# Altium project SiemensKarre.PrjPcb
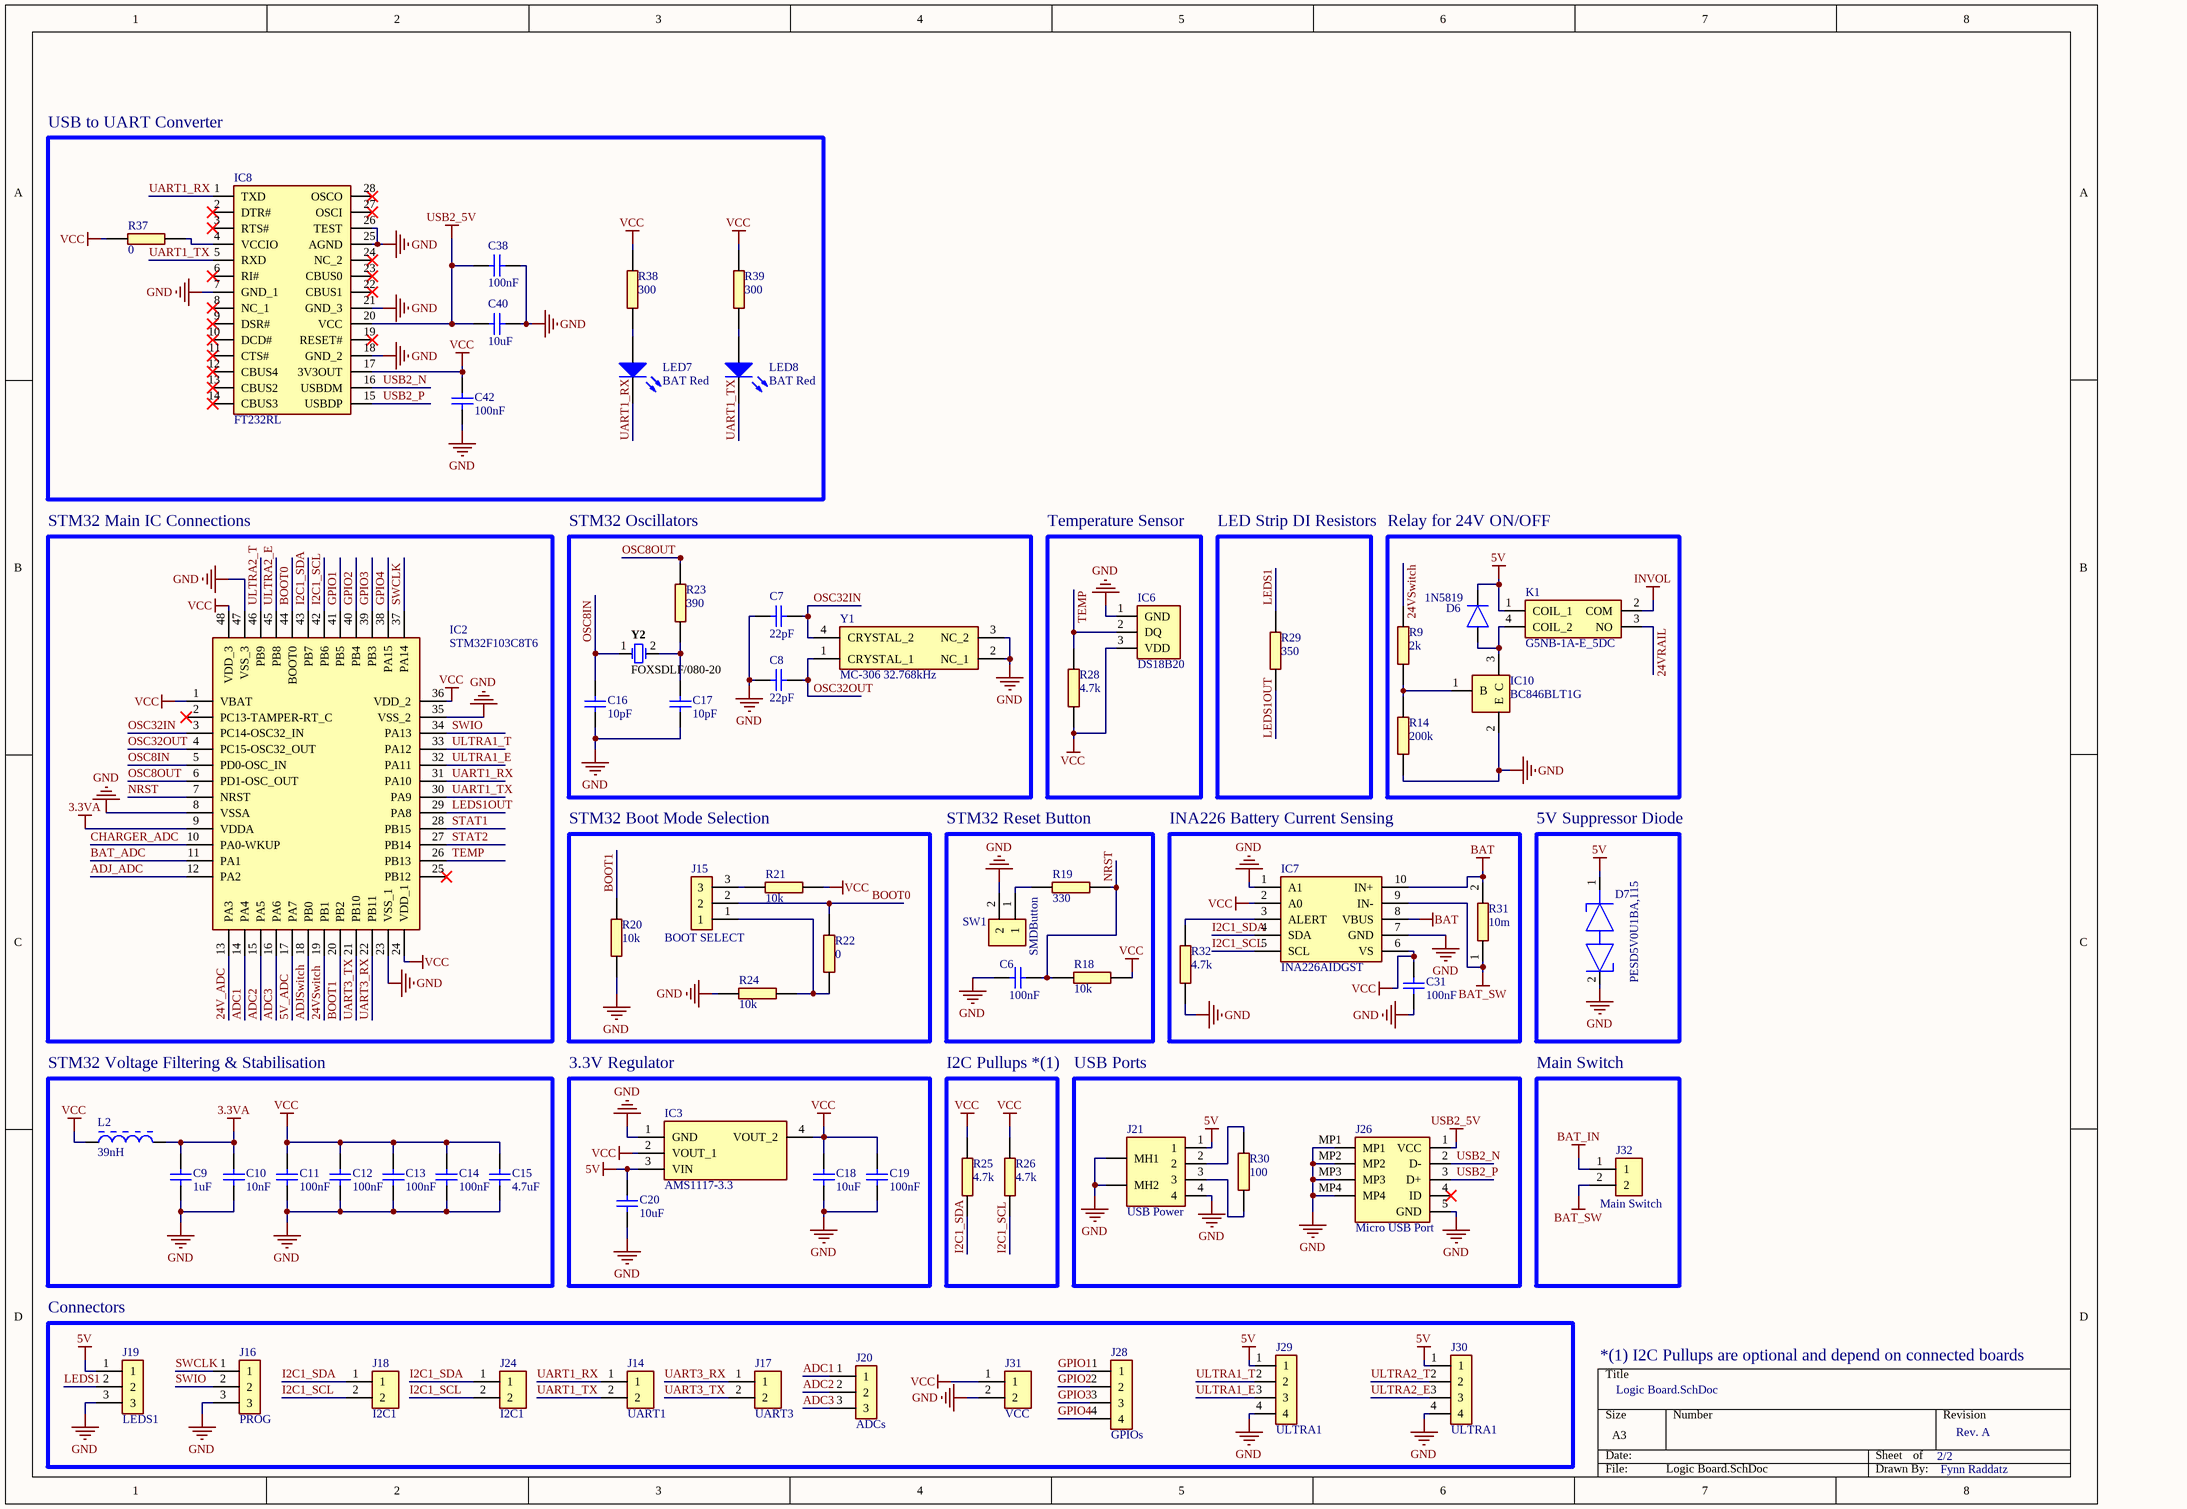
[diagram p0: Logic Board.SchDoc]
2 sheets, 145 parts. Net scope: global (net labels, ports and power ports of the same name join across sheets).
Board file: PSU PCB.PcbDoc
Sheets:
  Logic Board.SchDoc
  PSU Board.SchDoc

## Sheet Logic Board.SchDoc
size A3; SheetNumber: 1; SheetTotal: 2

### Parts
C6  100nF  [CAPC2012 METRIC]
C7  22pF  [CAPC2012 METRIC]
C8  22pF  [CAPC2012 METRIC]
C9  1uF  [CAPC2012 METRIC]
C10  10nF  [CAPC2012 METRIC]
C11  100nF  [CAPC2012 METRIC]
C12  100nF  [CAPC2012 METRIC]
C13  100nF  [CAPC2012 METRIC]
C14  100nF  [CAPC2012 METRIC]
C15  4.7uF  [CAPC2012 METRIC]
C16  10pF  [CAPC2012 METRIC]
C17  10pF  [CAPC2012 METRIC]
C18  10uF  [CAPC2012 METRIC]
C19  100nF  [CAPC2012 METRIC]
C20  10uF  [CAPC2012 METRIC]
C31  100nF  [CAPC2012 METRIC]
C38  100nF  [CAPC2012 METRIC]
C40  10uF  [CAPC2012 METRIC]
C42  100nF  [CAPC2012 METRIC]
D6  1N5819  [SOD3716X145N]
D7  PESD5V0U1BA,115  [PESD1IVN27AX]
IC2  STM32F103C8T6  [QFP50P900X900X160-48N]
IC3  AMS1117-3.3  [SOT229P700X180-4N]
IC6  DS18B20  [DS18B20TR]
IC7  INA226AIDGST  [SOP50P490X110-10N]
IC8  FT232RL  [SOP65P778X200-28N]
IC10  BC846BLT1G  [SOT96P237X111-3N]
J14  UART1  [2 Pin Header BIG PADS]
J15  BOOT SELECT  [HDRV3W64P0X254_1X3_762X254X869P]
J16  PROG  [HDRV3W64P0X254_1X3_762X254X869P]
J17  UART3  [2 Pin Header BIG PADS]
J18  I2C1  [2 Pin Header BIG PADS]
J19  LEDS1  [HDRV3W64P0X254_1X3_762X254X869P]
J20  ADCs  [HDRV3W64P0X254_1X3_762X254X869P]
J21  USB Power  [875200010BLF]
J24  I2C1  [2 Pin Header BIG PADS]
J26  Micro USB Port  [101041100001LF]
J28  GPIOs  [HDRV4W95P0X254_1X4_1016X254X854P]
J29  ULTRA1  [HDRV4W95P0X254_1X4_1016X254X854P]
J30  ULTRA1  [HDRV4W95P0X254_1X4_1016X254X854P]
J31  VCC  [2 Pin Header BIG PADS]
J32  Main Switch  [2 Pin Header BIG PADS]
K1  G5NB-1A-E_5DC  [G5NB1A4DC5]
L2  39nH  [LIRD-LI0805H151R-10-2_V]
LED7  BAT Red  [1206_A]
LED8  BAT Red  [1206_A]
R9  2k  [RESC2012X65N]
R14  200k  [RESC2012X65N]
R18  10k  [RESC2012X65N]
R19  330  [RESC2012X65N]
R20  10k  [RESC2012X65N]
R21  10k  [RESC2012X65N]
R22  0  [RESC2012X65N]
R23  390  [RESC2012X65N]
R24  10k  [RESC2012X65N]
R25  4.7k  [RESC2012X65N]
R26  4.7k  [RESC2012X65N]
R28  4.7k  [RESC2012X65N]
R29  350  [RESC2012X65N]
R30  100  [RESC2012X65N]
R31  10m  [RESC5025X88N]
R32  4.7k  [RESC2012X65N]
R37  0  [RESC2012X65N]
R38  300  [RESC2012X65N]
R39  300  [RESC2012X65N]
SW1  SMDButton  [SMD-Button-3*6mm]
Y1  MC-306 32.768kHz  [MC306327680KA3ROHS]
Y2  FOXSDLF/080-20  [FOX-HC49SDLF_V]

### Blocks framed on the sheet
USB to UART Converter: C38 C40 C42 IC8 LED7 LED8 R37-R39
STM32 Main IC Connections: IC2
STM32 Oscillators: C7 C8 C16 C17 R23 Y1 Y2
Temperature Sensor: IC6 R28
LED Strip DI Resistors: R29
Relay for 24V ON/OFF: D6 IC10 K1 R9 R14
STM32 Boot Mode Selection: J15 R20-R22 R24
STM32 Reset Button: C6 R18 R19 SW1
INA226 Battery Current Sensing: C31 IC7 R31 R32
5V Suppressor Diode: D7
STM32 Voltage Filtering & Stabilisation: C9-C15 L2
3.3V Regulator: C18-C20 IC3
I2C Pullups *(1): R25 R26
USB Ports: J21 J26 R30
Main Switch: J32
Connectors: J14 J16-J20 J24 J28-J31

### Nets
3.3VA: C9.2 C10.2 IC2.9(VDDA) L2.2
5V: C20.2 D6.1(K) D7.1(K1) IC3.3(VIN) J19.1 J21.1 J29.1 J30.1 K1.1(COIL_1)
BAT: IC7.8(VBUS) IC7.10(IN+) R31.2
BAT_IN: J32.1
BAT_SW: IC7.9(IN-) J32.2 R31.1
GND: C6.2 C7.2 C8.2 C9.1 C10.1 C11.1 C12.1 C13.1 C14.1 C15.1 C16.1 C17.1 C18.1 C19.1 C20.1 C31.1 C38.2 C40.2 C42.2 D7.2(K2) IC2.8(VSSA) IC2.23(VSS_1) IC2.35(VSS_2) IC2.47(VSS_3) IC3.1(GND) IC6.1(GND) IC7.1(A1) IC7.7(GND) IC8.7(GND_1) IC8.18(GND_2) IC8.21(GND_3) IC8.25(AGND) IC8.26(TEST) IC10.2(E) J16.3 J19.3 J21.4 J21.MH1 J21.MH2 J26.5(GND) J26.MP1 J26.MP2 J26.MP3 J26.MP4 J29.4 J30.4 J31.2 R14.1 R20.1 R24.1 R32.2 SW1.2 Y1.2(NC_1) Y1.3(NC_2)
INVOL: K1.2(COM)
USB2_5V: C38.1 C40.1 IC8.20(VCC) J26.1(VCC)
VCC: C11.2 C12.2 C13.2 C14.2 C15.2 C18.2 C19.2 C31.2 C42.1 IC2.1(VBAT) IC2.24(VDD_1) IC2.36(VDD_2) IC2.48(VDD_3) IC3.2(VOUT_1) IC3.4(VOUT_2) IC6.3(VDD) IC7.2(A0) IC7.6(VS) IC8.17(3V3OUT) J31.1 L2.1 R18.2 R21.1 R25.1 R26.1 R28.1 R37.2 R38.2 R39.2
5V_ADC: IC2.17(PA7)
24V_ADC: IC2.13(PA3)
24VRAIL: K1.3(NO)
24VSwitch: IC2.19(PB1) R9.2
ADC1: IC2.14(PA4) J20.1
ADC2: IC2.15(PA5) J20.2
ADC3: IC2.16(PA6) J20.3
ADJ_ADC: IC2.12(PA2)
ADJSwitch: IC2.18(PB0)
BAT_ADC: IC2.11(PA1)
BOOT0: IC2.44(BOOT0) J15.2 R22.1
BOOT1: IC2.20(PB2) R20.2
CHARGER_ADC: IC2.10(PA0-WKUP)
GPIO1: IC2.41(PB5) J28.1
GPIO2: IC2.40(PB4) J28.2
GPIO3: IC2.39(PB3) J28.3
GPIO4: IC2.38(PA15) J28.4
I2C1_SCL: IC2.42(PB6) IC7.5(SCL) J18.2 J24.2 R26.2
I2C1_SDA: IC2.43(PB7) IC7.4(SDA) J18.1 J24.1 R25.2
LEDS1: J19.2 R29.2
LEDS1OUT: IC2.29(PA8) R29.1
NRST: C6.1 IC2.7(NRST) R18.1 R19.1
OSC8IN: C16.2 IC2.5(PD0-OSC_IN) Y2.1
OSC8OUT: IC2.6(PD1-OSC_OUT) R23.2
OSC32IN: C7.1 IC2.3(PC14-OSC32_IN) Y1.4(CRYSTAL_2)
OSC32OUT: C8.1 IC2.4(PC15-OSC32_OUT) Y1.1(CRYSTAL_1)
STAT1: IC2.28(PB15)
STAT2: IC2.27(PB14)
SWCLK: IC2.37(PA14) J16.1
SWIO: IC2.34(PA13) J16.2
TEMP: IC2.26(PB13) IC6.2(DQ) R28.2
UART1_RX: IC2.31(PA10) IC8.1(TXD) J14.1 LED7.1(K)
UART1_TX: IC2.30(PA9) IC8.5(RXD) J14.2 LED8.1(K)
UART3_RX: IC2.22(PB11) J17.1
UART3_TX: IC2.21(PB10) J17.2
ULTRA1_E: IC2.32(PA11) J29.3
ULTRA1_T: IC2.33(PA12) J29.2
ULTRA2_E: IC2.45(PB8) J30.3
ULTRA2_T: IC2.46(PB9) J30.2
USB2_N: IC8.16(USBDM) J26.2(D-)
USB2_P: IC8.15(USBDP) J26.3(D+)
NetC17_2: C17.2 R23.1 Y2.2
NetD6_2: D6.2(A) IC10.3(C) K1.4(COIL_2)
NetIC7_3: IC7.3(ALERT) R32.1
NetIC8_4: IC8.4(VCCIO) R37.1
NetIC10_1: IC10.1(B) R9.1 R14.2
NetJ15_1: J15.1 R22.2 R24.2
NetJ15_3: J15.3 R21.2
NetJ21_2: J21.2 R30.1
NetJ21_3: J21.3 R30.2
NetLED7_2: LED7.2(A) R38.1
NetLED8_2: LED8.2(A) R39.1
NetR19_2: R19.2 SW1.1

Not connected (* = marked no-connect by the designer): IC2 2(PC13-TAMPER-RT_C)* 25(PB12)*; IC8 2(DTR#)* 3(RTS#)* 6(RI#)* 8(NC_1)* 9(DSR#)* 10(DCD#)* 11(CTS#)* 12(CBUS4)* 13(CBUS2)* 14(CBUS3)* 19(RESET#)* 22(CBUS1)* 23(CBUS0)* 24(NC_2)* 27(OSCI)* 28(OSCO)*; J26 4(ID)*

### Notes on the sheet
- *(1) I2C Pullups are optional and depend on connected boards
- 2/2
- Rev. A
- Fynn Raddatz

### Library data of the parts
C6-C20 C31 C38 C40 C42 = CL21B104KACNNNC: Capacitor; Manufacturer_Name: Samsung Electro-Mechanics; Datasheet Link: http://www.samsungsem.com/kr/support/product-search/mlcc/__icsFiles/afieldfile/2016/08/18/S_CL21B104KACNNNC.pdf; Height: 0.95mm; Manufacturer_Part_Number: CL21B104KACNNNC; Mouser Part Number: N/A; Mouser Price/Stock: https://www.mouser.co.uk/ProductDetail/Samsung-Electro-Mechanics/CL21B104KACNNNC?qs=yOVawPpwOwnhB47kNbieFw%3D%3D; Arrow Part Number: CL21B104KACNNNC; Arrow Price/Stock: https://www.arrow.com/en/products/cl21b104kacnnnc/samsung-electro-mechanics
D6 = 1N5819HW-7-F: Diode; Manufacturer_Name: Diodes Inc.; Datasheet Link: http://www.diodes.com/_files/datasheets/ds30217.pdf; Height: 1.45mm; Manufacturer_Part_Number: 1N5819HW-7-F; Mouser Part Number: 621-1N5819HW-F; Mouser Price/Stock: https://www.mouser.co.uk/ProductDetail/Diodes-Incorporated/1N5819HW-7-F/?qs=NQ47qNm99eDyWTEd07miYA%3D%3D; Arrow Part Number: 1N5819HW-7-F; Arrow Price/Stock: https://www.arrow.com/en/products/1n5819hw-7-f/diodes-incorporated
D7 = PESD5V0U1BA,115: Diode ESD (Bi-directional); Manufacturer_Name: Nexperia; Datasheet Link: https://assets.nexperia.com/documents/data-sheet/PESD5V0U1BA.pdf; Height: 1.1mm; Manufacturer_Part_Number: PESD5V0U1BA,115; Mouser Part Number: 771-PESD5V0U1BA115; Mouser Price/Stock: https://www.mouser.com/Search/Refine.aspx?Keyword=771-PESD5V0U1BA115; Arrow Part Number: PESD5V0U1BA,115; Arrow Price/Stock: https://www.arrow.com/en/products/pesd5v0u1ba115/nexperia
IC2 = STM32F103C8T6TR: Integrated Circuit; Manufacturer_Name: STMicroelectronics; Datasheet Link: http://media.digikey.com/pdf/Data%20Sheets/ST%20Microelectronics%20PDFS/STM32F103x8,B.pdf; Height: 1.6mm; Manufacturer_Part_Number: STM32F103C8T6TR; Mouser Part Number: 511-STM32F103C8T6TR; Mouser Price/Stock: https://www.mouser.co.uk/ProductDetail/STMicroelectronics/STM32F103C8T6TR/?qs=5HwTSiuA5HDxFj62n06yag%3D%3D; Arrow Part Number: STM32F103C8T6TR; Arrow Price/Stock: https://www.arrow.com/en/products/stm32f103c8t6tr/stmicroelectronics
IC3 = AMS1117-3.3: Integrated Circuit; Manufacturer_Name: Advanced Monolithic Systems; Datasheet Link: http://www.advanced-monolithic.com/pdf/ds1117.pdf; Height: 1.8mm; Manufacturer_Part_Number: AMS1117-3.3
IC6 = DS18B20+T&R: Integrated Circuit; Manufacturer_Name: Maxim Integrated; Datasheet Link: https://componentsearchengine.com/Datasheets/1/DS18B20+T&R.pdf; Height: 10.41mm; Manufacturer_Part_Number: DS18B20+T&R; Mouser Part Number: 700-DS18B20T&R; Mouser Price/Stock: https://www.mouser.co.uk/ProductDetail/Maxim-Integrated/DS18B20%2bTR/?qs=7H2Jq%252ByxpJKpIDCbiq4lfg%3D%3D
IC7 = INA226AIDGST: Integrated Circuit; Manufacturer_Name: Texas Instruments; Datasheet Link: http://www.ti.com/lit/gpn/ina226; Height: 1.1mm; Manufacturer_Part_Number: INA226AIDGST; Mouser Part Number: 595-INA226AIDGST; Mouser Price/Stock: https://www.mouser.co.uk/ProductDetail/Texas-Instruments/INA226AIDGST?qs=tQG3bEuiOZB3Ay2BJOjnEQ%3D%3D; Arrow Part Number: INA226AIDGST; Arrow Price/Stock: https://www.arrow.com/en/products/ina226aidgst/texas-instruments
IC8 = FT232RL: Integrated Circuit; Manufacturer_Name: FTDI Chip; Datasheet Link: http://www.ftdichip.com/Support/Documents/DataSheets/ICs/DS_FT232R.pdf; Height: 2mm; Manufacturer_Part_Number: FT232RL; Arrow Part Number: FT232RL; Arrow Price/Stock: https://www.arrow.com/en/products/ft232rl/ftdi-chip
IC10 = BC846BLT1G: Integrated Circuit; Manufacturer_Name: ON Semiconductor; Datasheet Link: http://www.onsemi.com/pub/Collateral/BC846ALT1-D.PDF; Height: 1.11mm; Manufacturer_Part_Number: BC846BLT1G; Mouser Part Number: 863-BC846BLT1G; Mouser Price/Stock: https://www.mouser.co.uk/ProductDetail/onsemi/BC846BLT1G?qs=vNc2DXHODiJuwwGLruzsRg%3D%3D; Arrow Part Number: BC846BLT1G; Arrow Price/Stock: https://www.arrow.com/en/products/bc846blt1g/on-semiconductor
J14 J17 J18 J24 J31 J32 = 2 Pin Header Big Pad: Connector; Manufacturer_Name: Wurth Elektronik; Manufacturer_Part_Number: 61300211121; Datasheet Link: https://componentsearchengine.com/Datasheets/2/61300211121.pdf; Height: 8.54mm; Mouser Part Number: 710-61300211121; Mouser Price/Stock: https://www.mouser.co.uk/ProductDetail/Wurth-Elektronik/61300211121/?qs=t4813l51qx%252B1A5GYDQxPlw%3D%3D
J15 J16 J19 J20 = 61300311121: Connector; Manufacturer_Name: Wurth Elektronik; Datasheet Link: http://katalog.we-online.de/em/datasheet/6130xx11121.pdf; Height: 8.69mm; Manufacturer_Part_Number: 61300311121; Mouser Part Number: 710-61300311121; Mouser Price/Stock: https://www.mouser.co.uk/ProductDetail/Wurth-Elektronik/61300311121/?qs=PhR8RmCirEYxRWFJzNKsUw%3D%3D
J21 = 87520-0010BLF: Connector; Manufacturer_Name: Amphenol; Datasheet Link: https://componentsearchengine.com/Datasheets/1/87520-0010BLF.pdf; Height: 7.8mm; Manufacturer_Part_Number: 87520-0010BLF; Mouser Part Number: 649-87520-0010BLF; Mouser Price/Stock: https://www.mouser.co.uk/ProductDetail/Amphenol-FCI/87520-0010BLF?qs=x6EjVpvqMVP%2F2to87x7cdQ%3D%3D; Arrow Part Number: 87520-0010BLF; Arrow Price/Stock: https://www.arrow.com/en/products/87520-0010blf/amphenol-fci
J26 = Micro USB Port: Connector; Manufacturer_Name: Amphenol; Manufacturer_Part_Number: 10104110-0001LF; Datasheet Link: https://componentsearchengine.com/Datasheets/1/10104110-0001LF.pdf; Height: 2.98mm; Mouser Part Number: 649-10104110-0001LF; Mouser Price/Stock: https://www.mouser.co.uk/ProductDetail/Amphenol-FCI/10104110-0001LF?qs=3wMSRtz0%252BRoQF1VV4tle7w%3D%3D; Arrow Part Number: 10104110-0001LF; Arrow Price/Stock: https://www.arrow.com/en/products/10104110-0001lf/amphenol-fci?region=nac
J28-J30 = 61300411121: Connector; Manufacturer_Name: Wurth Elektronik; Datasheet Link: http://katalog.we-online.de/em/datasheet/6130xx11121.pdf; Height: 8.54mm; Manufacturer_Part_Number: 61300411121; Mouser Part Number: 710-61300411121; Mouser Price/Stock: https://www.mouser.co.uk/ProductDetail/Wurth-Elektronik/61300411121?qs=PhR8RmCirEYQcLLqXD8rAA%3D%3D
K1 = G5NB-1A-E_5DC: Relay or Contactor; Manufacturer_Name: Omron Electronics; Manufacturer_Part_Number: G5NB-1A-E 5DC; Datasheet Link: https://omronfs.omron.com/en_US/ecb/products/pdf/en-g5nb.pdf; Height: 15mm
L2 = CMP-2000-06404-1: Chip Bead, 100 MHz, 5 A, -40 to 125 degC, 2-Pin SMD (0805), RoHS, Tape and Reel; Manufacturer: Laird; DC Resistance (DCR) (Max): 10mOhm; Current Rating (Max): 5A; Kits: 240-2227-ND-KITEMIFERRITEBEADCHIPSMD; Filter Type: Power,SignalLine; Impedance @ Frequency: 80Ohm@100MHz; Online Catalog: HISeries; Other Names: 240-2395-1; Catalog Drawings: (HI,HZ,LI,MI)0805Series_1.10mmMax.Height; Package Version: Rev. D, 08/2013; Number of Lines: 1; Package / Case: 0805(2012Metric); Package URL: http://cdn.lairdtech.com/home/brandworld/files/LI0805H151R-10.pdf; Standard Package: 1; Manufacturer URL: https://www.lairdtech.com/; Ratings: -; Height (Max): 0.043"(1.10mm); Package Description: 2-Pin Surface Mount Device, Body 2 x 1.25 mm; Category: Filters; Series: HI; Packaging: CutTape(CT); Package Reference: LI0805H15R-10-2; Operating Temperature: -40°C~125°C; Datasheet URL: http://cdn.lairdtech.com/home/brandworld/files/HI0805R800R-10.pdf; Size / Dimension: 0.079"Lx0.049"W(2.00mmx1.25mm); Datasheet Version: Rev. E, 08/2013; Mounting Type: SurfaceMount; Family: FerriteBeadsandChips; Mounting Technology: SurfaceMount
LED7 LED8 = CMP-1426-00014-1: SMD mono-color Chip LED, WL-SMCW, Green; Manufacturer: Wuerth Elektronik; PartNumber: 150120GS75000; PackageReference: 1206_A; ComponentLink1Description: Manufacturer URL; ComponentLink2URL: http://katalog.we-online.com/led/datasheet/150120GS75000.pdf; ComponentLink2Description: Datasheet; Color: Green; ComponentLink1URL: http://www.we-online.com
R9 R14 R18-R26 R28-R30 R32 R37-R39 = RMCF0805ZT0R00: Resistor; Manufacturer_Name: Stackpole Electronics Inc.; Datasheet Link: https://www.seielect.com/Catalog/SEI-RMCF_RMCP.pdf; Height: 0.65mm; Manufacturer_Part_Number: RMCF0805ZT0R00; Arrow Part Number: RMCF0805ZT0R00; Arrow Price/Stock: https://www.arrow.com/en/products/rmcf0805zt0r00/stackpole-electronics
R31 = WSL2010R0100FEA18: Resistor; Manufacturer_Name: Vishay; Datasheet Link: http://componentsearchengine.com/Datasheets/1/WSL2010R0100FEA18.pdf; Manufacturer_Part_Number: WSL2010R0100FEA18; Mouser Part Number: 71-WSL2010R0100FEA18; Mouser Price/Stock: https://www.mouser.co.uk/ProductDetail/Vishay-Dale/WSL2010R0100FEA18?qs=IZrxGxQQvkOPmTjw6svrGg%3D%3D; Arrow Part Number: WSL2010R0100FEA18; Arrow Price/Stock: https://www.arrow.com/en/products/wsl2010r0100fea18/vishay?region=nac
SW1 = SMDButton-3*6mm
Y1 = MC-306_32.7680K-A3_ROHS: Crystal or Oscillator; Manufacturer_Name: Epson Timing; Manufacturer_Part_Number: MC-306 32.7680K-A3:ROHS; Datasheet Link: https://componentsearchengine.com/Datasheets/1/MC-306 32.7680K-A3_ROHS.pdf; Height: 2.54mm; Mouser Part Number: 732-MC306-32.7KA3R; Mouser Price/Stock: https://www.mouser.co.uk/ProductDetail/Epson-Timing/MC-306-327680K-A3ROHS/?qs=CU9taR8hkvbxBMNmXnQ1pw%3D%3D
Y2 = CMP-2100-03639-1: Resistance Weld Crystal, 8 MHz, +/- 30 ppm, -20 to 70 degC, 2-Pin SMD, RoHS, Tape and Reel; Manufacturer: FOX Electronics; Series Resistance: 80Ohm; Frequency: 8MHz; Load Capacitance: 20pF; Tolerance: 50ppm; Frequency Tolerance: 30ppm; Datasheet URL: http://www.foxonline.com/pdfs/hc49sdlf.pdf; Package Reference: HC49SDLF; Height: 4.5mm; Mount: SurfaceMount; Packaging: TapeandReel; Length: 11.7mm; Termination: SMD/SMT; Number of Pins: 2; Depth: 5mm; Min Operating Temperature: -20degC; Package Quantity: 1000; RoHSCompliant: True; Lead Free: LeadFree; Width: 5mm; Case/Package: SMD/SMT; Manufacturer URL: http://www.foxonline.com/; Max Operating Temperature: 70degC; REACH SVHC: NoSVHC; Datasheet Version: 42064.0; Package Description: 2-Pin Surface Mount Device, Body 5 x 11.7 mm; Frequency Stability: 50ppm; ESR (Equivalent Series Resistance): 80Ohm; Radiation Hardening: No

## Sheet PSU Board.SchDoc
size A4; Author: Fynn Raddatz; DrawnBy: Fynn Raddatz; DocumentNumber: 1; SheetNumber: 2; SheetTotal: 2
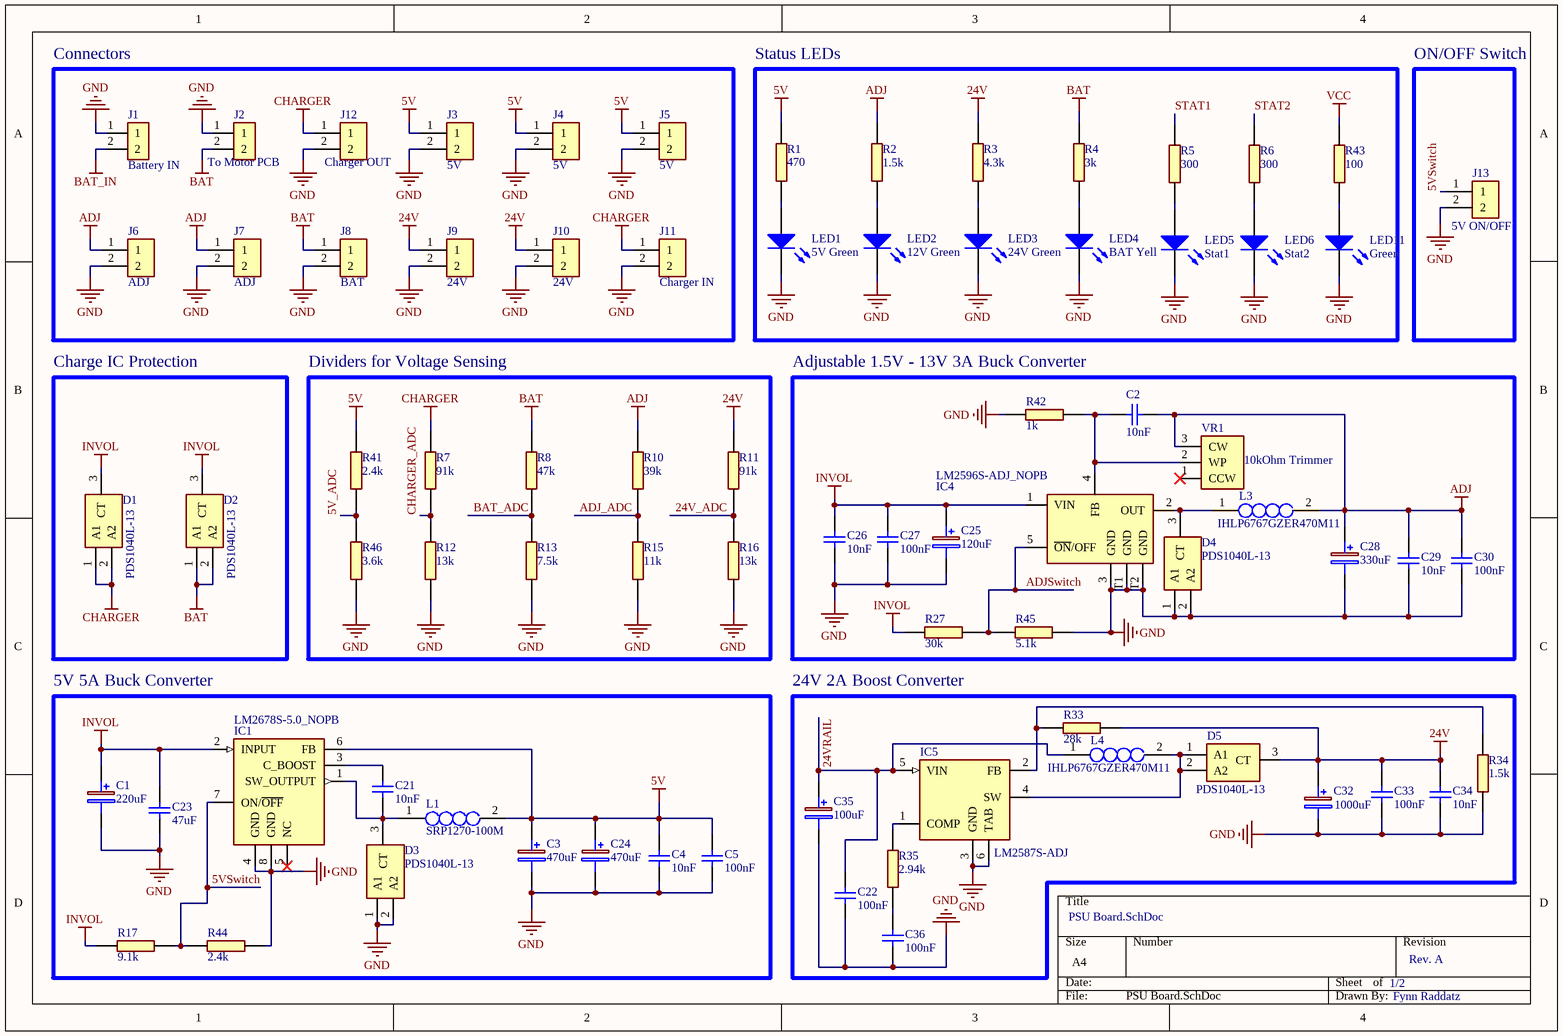
[diagram p1: PSU Board.SchDoc]

### Parts
C1  220uF  [CAPAE830X650N]
C2  10nF  [CAPC2012 METRIC]
C3  470uF  [CAPAE830X650N]
C4  10nF  [CAPC2012 METRIC]
C5  100nF  [CAPC2012 METRIC]
C21  10nF  [CAPC2012 METRIC]
C22  100nF  [CAPC2012 METRIC]
C23  47uF  [CAPC2012 METRIC]
C24  470uF  [CAPAE830X650N]
C25  120uF  [CAPAE830X650N]
C26  10nF  [CAPC2012 METRIC]
C27  100nF  [CAPC2012 METRIC]
C28  330uF  [CAPAE830X650N]
C29  10nF  [CAPC2012 METRIC]
C30  100nF  [CAPC2012 METRIC]
C32  1000uF  [CAPAE830X650N]
C33  100nF  [CAPC2012 METRIC]
C34  10nF  [CAPC2012 METRIC]
C35  100uF  [CAPAE830X650N]
C36  100nF  [CAPC2012 METRIC]
D1  PDS1040L-13  [POWERDI5]
D2  PDS1040L-13  [POWERDI5]
D3  PDS1040L-13  [POWERDI5]
D4  PDS1040L-13  [POWERDI5]
D5  PDS1040L-13  [POWERDI5]
IC1  LM2678S-5.0_NOPB  [TO127P1435X464-8N]
IC4  LM2596S-ADJ_NOPB  [LM2596SXADJ]
IC5  LM2587S-ADJ  [TO170P1435X465-6N]
J1  Battery IN  [XT30PB]
J2  To Motor PCB  [XT30PB]
J3  5V  [2 Pin Header BIG PADS]
J4  5V  [2 Pin Header BIG PADS]
J5  5V  [2 Pin Header BIG PADS]
J6  ADJ  [2 Pin Header BIG PADS]
J7  ADJ  [2 Pin Header BIG PADS]
J8  BAT  [2 Pin Header BIG PADS]
J9  24V  [2 Pin Header BIG PADS]
J10  24V  [2 Pin Header BIG PADS]
J11  Charger IN  [2 Pin Header BIG PADS]
J12  Charger OUT  [2 Pin Header BIG PADS]
J13  5V ON/OFF  [2 Pin Header BIG PADS]
L1  SRP1270-100M  [RSPRO_Spule10u]
L3  IHLP6767GZER470M11  [INDPM172172X700N]
L4  IHLP6767GZER470M11  [INDPM172172X700N]
LED1  5V Green  [1206_A]
LED2  12V Green  [1206_A]
LED3  24V Green  [1206_A]
LED4  BAT Yell  [1206_A]
LED5  Stat1  [1206_A]
LED6  Stat2  [1206_A]
LED11  Green  [1206_A]
R1  470  [RESC2012X65N]
R2  1.5k  [RESC2012X65N]
R3  4.3k  [RESC2012X65N]
R4  3k  [RESC2012X65N]
R5  300  [RESC2012X65N]
R6  300  [RESC2012X65N]
R7  91k  [RESC2012X65N]
R8  47k  [RESC2012X65N]
R10  39k  [RESC2012X65N]
R11  91k  [RESC2012X65N]
R12  13k  [RESC2012X65N]
R13  7.5k  [RESC2012X65N]
R15  11k  [RESC2012X65N]
R16  13k  [RESC2012X65N]
R17  9.1k  [RESC2012X65N]
R27  30k  [RESC2012X65N]
R33  28k  [RESC2012X65N]
R34  1.5k  [RESC2012X65N]
R35  2.94k  [RESC2012X65N]
R41  2.4k  [RESC2012X65N]
R42  1k  [RESC2012X65N]
R43  100  [RESC2012X65N]
R44  2.4k  [RESC2012X65N]
R45  5.1k  [RESC2012X65N]
R46  3.6k  [RESC2012X65N]
VR1  10kOhm Trimmer  [3296W-1]

### Blocks framed on the sheet
Connectors: J1-J12
Status LEDs: LED1-LED6 LED11 R1-R6 R43
ON/OFF Switch: J13
Charge IC Protection: D1 D2
Dividers for Voltage Sensing: R7 R8 R10-R13 R15 R16 R41 R46
Adjustable 1.5V - 13V 3A Buck Converter: C2 C25-C30 D4 IC4 L3 R27 R42 R45 VR1
5V 5A Buck Converter: C1 C3-C5 C21 C23 C24 D3 IC1 L1 R17 R44
24V 2A Boost Converter: C22 C32-C36 D5 IC5 L4 R33-R35

### Nets
5V: C3.1(+) C4.2 C5.2 C24.1(+) IC1.6(FB) J3.1 J4.1 J5.1 L1.2 R1.2 R41.2
24V: C32.1(+) C33.2 C34.2 D5.3(CT) J9.1 J10.1 R3.2 R11.2 R33.2
ADJ: C2.1 C28.1(+) C29.2 C30.2 J6.1 J7.1 L3.2 R2.2 R10.2 VR1.3(CW)
BAT: D2.1(A1) D2.2(A2) J2.2 J8.1 R4.2 R8.2
BAT_IN: J1.2
CHARGER: D1.1(A1) D1.2(A2) J11.1 J12.1 R7.2
GND: C1.2(-) C3.2(-) C4.1 C5.1 C22.1 C23.1 C24.2(-) C25.2(-) C26.1 C27.1 C28.2(-) C29.1 C30.1 C32.2(-) C33.1 C34.1 C35.2(-) C36.1 D3.1(A1) D3.2(A2) D4.1(A1) D4.2(A2) IC1.4(GND) IC1.8(GND) IC4.3(GND) IC4.T1(GND) IC4.T2(GND) IC5.3(GND) IC5.6(TAB) J1.1 J2.1 J3.2 J4.2 J5.2 J6.2 J7.2 J8.2 J9.2 J10.2 J11.2 J12.2 J13.2 LED1.1(K) LED2.1(K) LED3.1(K) LED4.1(K) LED5.1(K) LED6.1(K) LED11.1(K) R12.1 R13.1 R15.1 R16.1 R34.1 R42.2 R44.1 R45.1 R46.1
INVOL: C1.1(+) C23.2 C25.1(+) C26.2 C27.2 D1.3(CT) D2.3(CT) IC1.2(INPUT) IC4.1(VIN) R17.2 R27.2
VCC: R43.2
5V_ADC: R41.1 R46.2
5VSwitch: IC1.7(ON/~{OFF}) J13.1 R17.1 R44.2
24V_ADC: R11.1 R16.2
24VRAIL: C22.2 C35.1(+) IC5.5(VIN) L4.1
ADJ_ADC: R10.1 R15.2
ADJSwitch: IC4.5(~{ON}/OFF) R27.1 R45.2
BAT_ADC: R8.1 R13.2
CHARGER_ADC: R7.1 R12.2
STAT1: R5.2
STAT2: R6.2
NetC2_2: C2.2 IC4.4(FB) R42.1 VR1.2(WP)
NetC21_1: C21.1 D3.3(CT) IC1.1(SW_OUTPUT) L1.1
NetC21_2: C21.2 IC1.3(C_BOOST)
NetC36_2: C36.2 R35.2
NetD4_3: D4.3(CT) IC4.2(OUT) L3.1
NetD5_1: D5.1(A1) D5.2(A2) IC5.4(SW) L4.2
NetIC5_1: IC5.1(COMP) R35.1
NetIC5_2: IC5.2(FB) R33.1 R34.2
NetLED1_2: LED1.2(A) R1.1
NetLED2_2: LED2.2(A) R2.1
NetLED3_2: LED3.2(A) R3.1
NetLED4_2: LED4.2(A) R4.1
NetLED5_2: LED5.2(A) R5.1
NetLED6_2: LED6.2(A) R6.1
NetLED11_2: LED11.2(A) R43.1

Not connected (* = marked no-connect by the designer): IC1 5(NC)*; VR1 1(CCW)*

### Notes on the sheet
- 1/2
- Rev. A
- Fynn Raddatz

### Library data of the parts
C1 C3 C24 C25 C28 C32 C35 = EEE-FK1A221P: Capacitor Polarised; Manufacturer_Name: Panasonic; Datasheet Link: https://industrial.panasonic.com/cdbs/www-data/pdf/RDE0000/ABA0000C1181.pdf; Height: 6.5mm; Manufacturer_Part_Number: EEE-FK1A221P; Mouser Part Number: 667-EEE-FK1A221P; Mouser Price/Stock: https://www.mouser.co.uk/ProductDetail/Panasonic/EEE-FK1A221P?qs=qE6bgDGEOCsoedkYjAEKdg%3D%3D; Arrow Part Number: EEE-FK1A221P; Arrow Price/Stock: https://www.arrow.com/en/products/eee-fk1a221p/panasonic
C2 C4 C5 C21-C23 C26 C27 C29 C30 C33 C34 C36 = CL21B104KACNNNC: as C6 on sheet Logic Board; Datasheet Link: http://www.samsungsem.com/kr/support/product-search/mlcc/__icsFiles/afieldfile/2016/08/18/S_CL21B104KACNNNC.pdf; Height: 0.95mm; Manufacturer_Part_Number: CL21B104KACNNNC; Mouser Part Number: N/A; Mouser Price/Stock: https://www.mouser.co.uk/ProductDetail/Samsung-Electro-Mechanics/CL21B104KACNNNC?qs=yOVawPpwOwnhB47kNbieFw%3D%3D; Arrow Part Number: CL21B104KACNNNC; Arrow Price/Stock: https://www.arrow.com/en/products/cl21b104kacnnnc/samsung-electro-mechanics
D1-D5 = PDS1040L-13: Diode; Manufacturer_Name: Diodes Inc.; Datasheet Link: https://www.diodes.com/assets/Datasheets/ds30486.pdf; Manufacturer_Part_Number: PDS1040L-13; Mouser Part Number: 621-PDS1040L-13; Mouser Price/Stock: https://www.mouser.co.uk/ProductDetail/Diodes-Incorporated/PDS1040L-13?qs=rNZh4F5RthQSjKiPhlxJLw%3D%3D; Arrow Part Number: PDS1040L-13; Arrow Price/Stock: https://www.arrow.com/en/products/pds1040l-13/diodes-incorporated
IC1 = LM2678S-5.0_NOPB: Integrated Circuit; Manufacturer_Name: Texas Instruments; Manufacturer_Part_Number: LM2678S-5.0/NOPB; Datasheet Link: http://docs-emea.rs-online.com/webdocs/10fa/0900766b810fa439.pdf; Height: 4.64mm; Mouser Part Number: 926-LM2678S-5.0/NOPB; Mouser Price/Stock: https://www.mouser.co.uk/ProductDetail/Texas-Instruments/LM2678S-50-NOPB?qs=X1J7HmVL2ZEIcu2ww8kGrA%3D%3D; Arrow Part Number: LM2678S-5.0/NOPB; Arrow Price/Stock: https://www.arrow.com/en/products/lm2678s-5.0nopb/texas-instruments
IC4 = LM2596S-ADJ_NOPB: Integrated Circuit; Manufacturer_Name: Texas Instruments; Manufacturer_Part_Number: LM2596S-ADJ/NOPB; Datasheet Link: https://www.ti.com/lit/ds/symlink/lm2596.pdf?HQS=ti-null-null-sf-df-pf-sep-wwe&ts=1592978195629; Height: 4.57mm; Mouser Part Number: 926-LM2596S-ADJ/NOPB; Mouser Price/Stock: https://www.mouser.co.uk/ProductDetail/Texas-Instruments/LM2596S-ADJ-NOPB?qs=X1J7HmVL2ZHoMN0DLDcNog%3D%3D; Arrow Part Number: LM2596S-ADJ/NOPB; Arrow Price/Stock: https://www.arrow.com/en/products/lm2596s-adjnopb/texas-instruments?region=nac
IC5 = LM2587S-ADJ_NOPB: Integrated Circuit; Manufacturer_Name: Texas Instruments; Manufacturer_Part_Number: LM2587S-ADJ/NOPB; Datasheet Link: http://www.ti.com/lit/ds/symlink/lm2587.pdf; Height: 4.65mm; Mouser Part Number: 926-LM2587S-ADJ/NOPB; Mouser Price/Stock: https://www.mouser.co.uk/ProductDetail/Texas-Instruments/LM2587S-ADJ-NOPB?qs=X1J7HmVL2ZEPViE%252BXoggZw%3D%3D; Arrow Part Number: LM2587S-ADJ/NOPB; Arrow Price/Stock: https://www.arrow.com/en/products/lm2587s-adjnopb/texas-instruments
J1 J2 = XT30PB: Connector; Manufacturer_Name: Amass; Datasheet Link: https://www.tme.eu/Document/4acc913878197f8c2e30d4b8cdc47230/XT30UPB%20SPEC.pdf; Height: 10.7mm; Manufacturer_Part_Number: XT30PB
J3-J13 = 2 Pin Header Big Pad: as J14 on sheet Logic Board; Datasheet Link: https://componentsearchengine.com/Datasheets/2/61300211121.pdf; Height: 8.54mm; Mouser Part Number: 710-61300211121; Mouser Price/Stock: https://www.mouser.co.uk/ProductDetail/Wurth-Elektronik/61300211121/?qs=t4813l51qx%252B1A5GYDQxPlw%3D%3D
L1 = SRP1270-100M: Inductor; Manufacturer_Name: Bourns; Datasheet Link: https://www.bourns.com/pdfs/SRP1270.pdf; Height: 7mm; Manufacturer_Part_Number: SRP1270-100M; Mouser Part Number: 652-SRP1270-100M; Mouser Price/Stock: https://www.mouser.co.uk/ProductDetail/Bourns/SRP1270-100M?qs=s%252BX%2FYkvGCpE5rFNaoMUDIw%3D%3D; Arrow Part Number: SRP1270-100M; Arrow Price/Stock: https://www.arrow.com/en/products/srp1270-100m/bourns
L3 L4 = IHLP6767GZER470M11: Inductor; Manufacturer_Name: Vishay; Datasheet Link: https://www.vishay.com/docs/34282/lp67gz11.pdf; Height: 7mm; Manufacturer_Part_Number: IHLP6767GZER470M11; Mouser Part Number: 70-IHLP6767GZER470M1; Mouser Price/Stock: https://www.mouser.co.uk/ProductDetail/Vishay-Dale/IHLP6767GZER470M11?qs=XqCRimLFoQtd31Wi9i7V1Q%3D%3D; Arrow Part Number: IHLP6767GZER470M11; Arrow Price/Stock: https://www.arrow.com/en/products/ihlp6767gzer470m11/vishay
LED1-LED6 LED11 = CMP-1426-00014-1: as LED7 on sheet Logic Board; PackageReference: 1206_A; ComponentLink1Description: Manufacturer URL; ComponentLink2URL: http://katalog.we-online.com/led/datasheet/150120GS75000.pdf; ComponentLink2Description: Datasheet; Color: Green; ComponentLink1URL: http://www.we-online.com
R1-R8 R10-R13 R15-R17 R27 R33-R35 R41-R46 = Res 0805: Resistor; Manufacturer_Name: Stackpole Electronics Inc.; Manufacturer_Part_Number: RMCF0805ZT0R00; Datasheet Link: https://www.seielect.com/Catalog/SEI-RMCF_RMCP.pdf; Height: 0.65mm; Arrow Part Number: RMCF0805ZT0R00; Arrow Price/Stock: https://www.arrow.com/en/products/rmcf0805zt0r00/stackpole-electronics
VR1 = 3296W-1-103LF: Variable Resistor; Manufacturer_Name: Bourns; Datasheet Link: https://www.bourns.com/pdfs/3296.pdf; Manufacturer_Part_Number: 3296W-1-103LF; Mouser Part Number: 652-3296W-1-103LF; Mouser Price/Stock: https://www.mouser.co.uk/ProductDetail/Bourns/3296W-1-103LF?qs=CL3xLxiry19Id6AEaxYcng%3D%3D; Arrow Part Number: 3296W-1-103LF; Arrow Price/Stock: https://www.arrow.com/en/products/3296w-1-103lf/bourns?region=nac

## Nets that join several sheets
5V: Logic Board (9 pins), PSU Board (11 pins)
BAT: Logic Board (IC7.8 IC7.10 R31.2), PSU Board (6 pins)
BAT_IN: Logic Board (J32.1), PSU Board (J1.2)
GND: Logic Board (54 pins), PSU Board (58 pins)
INVOL: Logic Board (K1.2), PSU Board (11 pins)
VCC: Logic Board (29 pins), PSU Board (R43.2)
5V_ADC: Logic Board (IC2.17), PSU Board (R41.1 R46.2)
24V_ADC: Logic Board (IC2.13), PSU Board (R11.1 R16.2)
24VRAIL: Logic Board (K1.3), PSU Board (C22.2 C35.1 IC5.5 L4.1)
ADJ_ADC: Logic Board (IC2.12), PSU Board (R10.1 R15.2)
ADJSwitch: Logic Board (IC2.18), PSU Board (IC4.5 R27.1 R45.2)
BAT_ADC: Logic Board (IC2.11), PSU Board (R8.1 R13.2)
CHARGER_ADC: Logic Board (IC2.10), PSU Board (R7.1 R12.2)
STAT1: Logic Board (IC2.28), PSU Board (R5.2)
STAT2: Logic Board (IC2.27), PSU Board (R6.2)